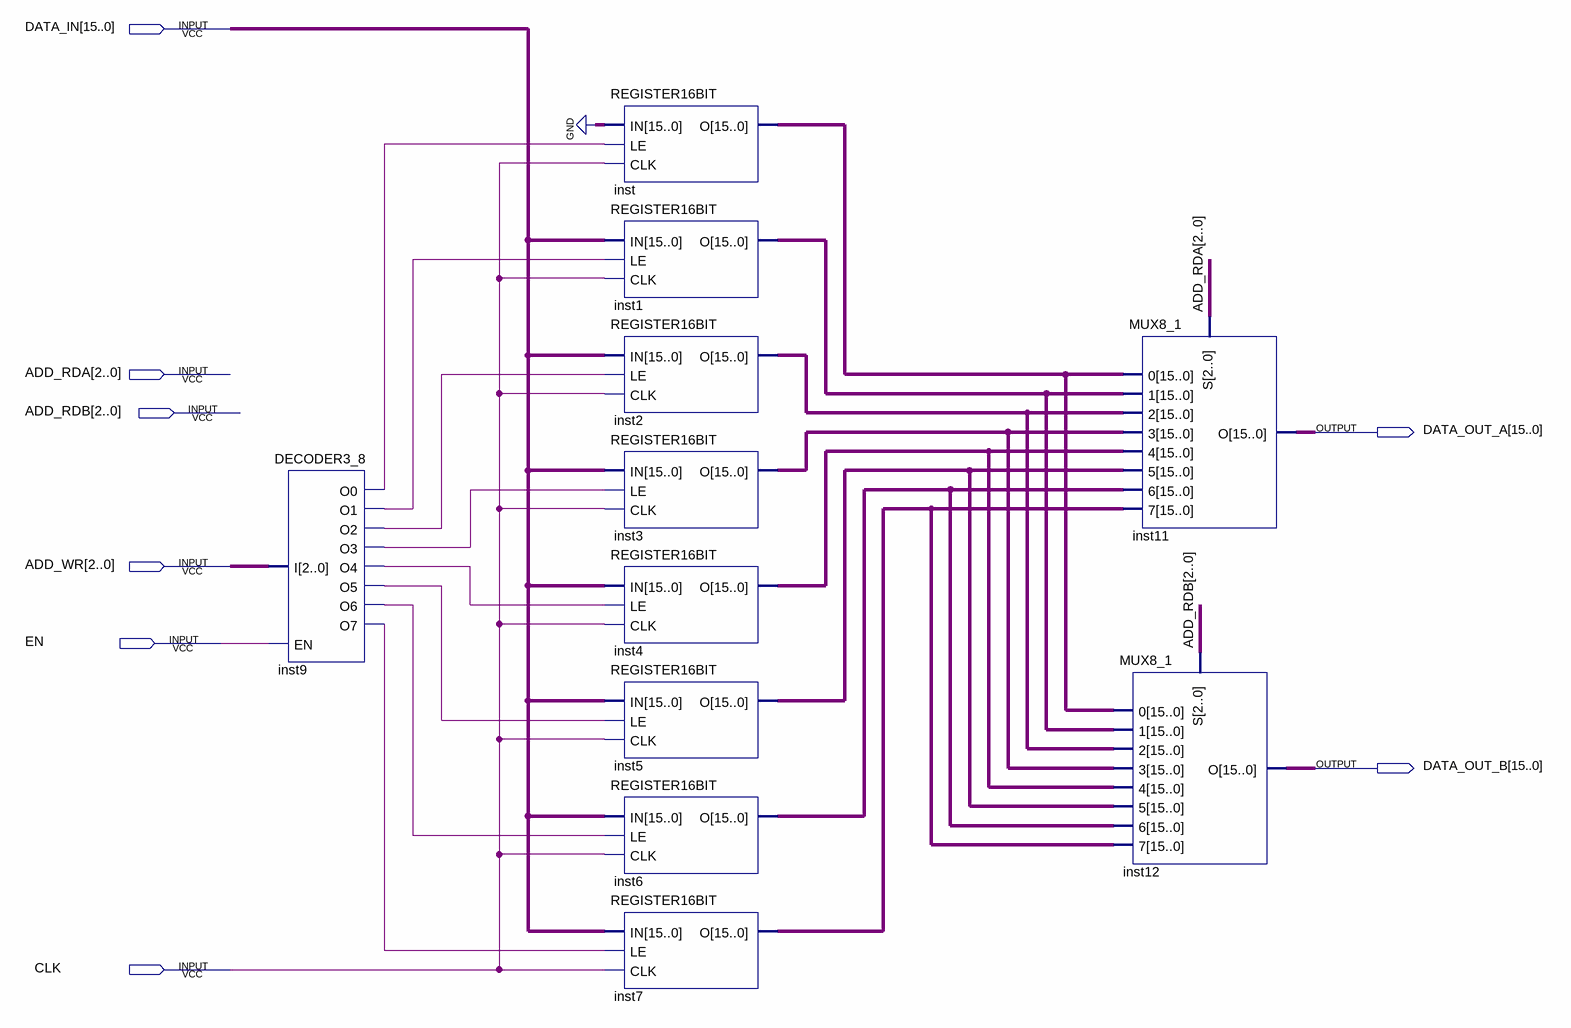
[diagram p0: schematic sheet]
// Quartus schematic REGISTERFILE.bdf as structural Verilog: 11 symbols, 8 pins
module REGISTERFILE (
  input  [15:0] DATA_IN,
  input  [2:0] ADD_RDA,
  input  [2:0] ADD_RDB,
  input  [2:0] ADD_WR,
  input  EN,
  input  CLK,
  output [15:0] DATA_OUT_A,
  output [15:0] DATA_OUT_B
);

  wire inst9_o0, inst9_o1, inst9_o2, inst9_o3, inst9_o4, inst9_o5, inst9_o6, inst9_o7;
  wire [15:0] inst1_o, inst2_o, inst3_o, inst4_o, inst5_o, inst6_o, inst7_o, inst_o;

  DECODER3_8 inst9 (
    .EN(EN), .I(ADD_WR), .O0(inst9_o0), .O1(inst9_o1), .O2(inst9_o2), .O3(inst9_o3), .O4(inst9_o4),
    .O5(inst9_o5), .O6(inst9_o6), .O7(inst9_o7));
  REGISTER16BIT inst (.IN({16{1'b0}}), .LE(inst9_o0), .CLK(CLK), .O(inst_o));
  REGISTER16BIT inst1 (.IN(DATA_IN), .LE(inst9_o1), .CLK(CLK), .O(inst1_o));
  REGISTER16BIT inst2 (.IN(DATA_IN), .LE(inst9_o2), .CLK(CLK), .O(inst2_o));
  REGISTER16BIT inst3 (.IN(DATA_IN), .LE(inst9_o3), .CLK(CLK), .O(inst3_o));
  REGISTER16BIT inst4 (.IN(DATA_IN), .LE(inst9_o4), .CLK(CLK), .O(inst4_o));
  REGISTER16BIT inst5 (.IN(DATA_IN), .LE(inst9_o5), .CLK(CLK), .O(inst5_o));
  REGISTER16BIT inst6 (.IN(DATA_IN), .LE(inst9_o6), .CLK(CLK), .O(inst6_o));
  REGISTER16BIT inst7 (.IN(DATA_IN), .LE(inst9_o7), .CLK(CLK), .O(inst7_o));
  MUX8_1 inst11 (
    .S(ADD_RDA), .\0 (inst_o), .\1 (inst1_o), .\2 (inst2_o), .\3 (inst3_o), .\4 (inst4_o), .\5 (inst5_o),
    .\6 (inst6_o), .\7 (inst7_o), .O(DATA_OUT_A));
  MUX8_1 inst12 (
    .S(ADD_RDB), .\0 (inst_o), .\1 (inst1_o), .\2 (inst2_o), .\3 (inst3_o), .\4 (inst4_o), .\5 (inst5_o),
    .\6 (inst6_o), .\7 (inst7_o), .O(DATA_OUT_B));
endmodule
